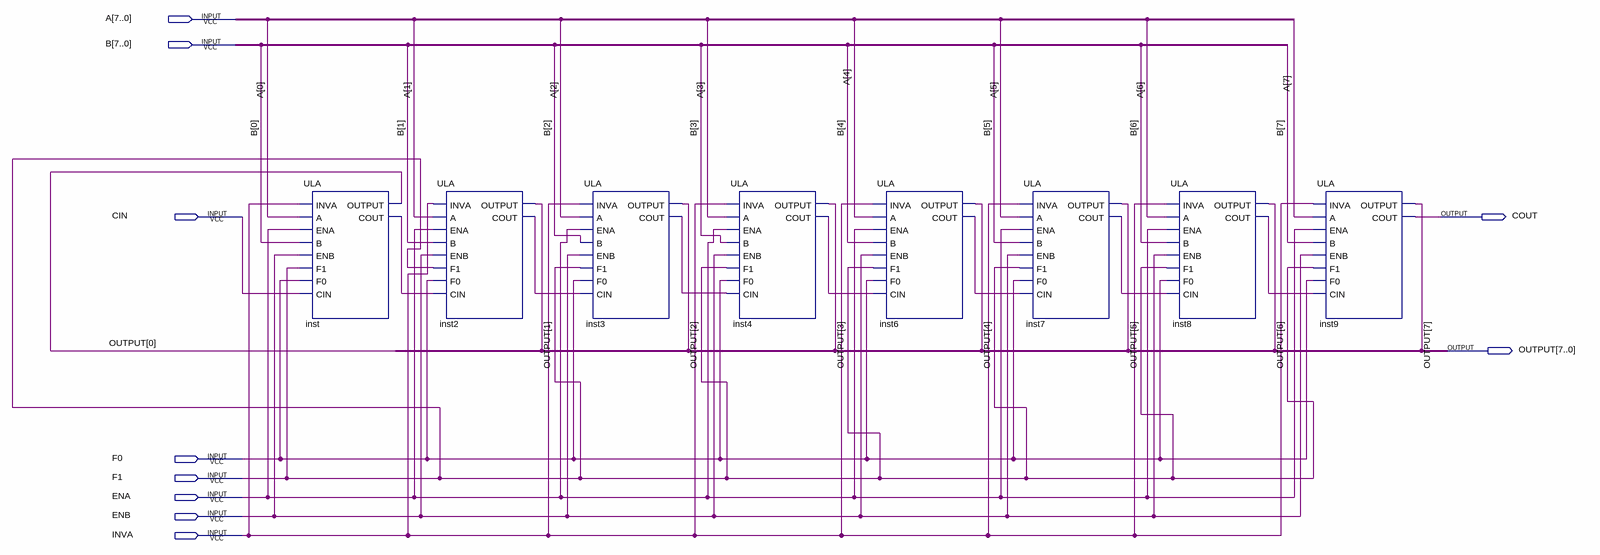
[diagram p0: schematic sheet]
// Quartus schematic ULA_8BIT.bdf as structural Verilog: 8 symbols, 10 pins
module ULA_8BIT (
  input  [7:0] A,
  input  [7:0] B,
  input  CIN,
  input  F0,
  input  F1,
  input  ENA,
  input  ENB,
  input  INVA,
  output COUT,
  output [7:0] OUTPUT
);

  wire inst2_cout, inst3_cout, inst4_cout, inst6_cout, inst7_cout, inst8_cout, inst_cout;

  ULA inst (
    .INVA(INVA), .A(A[0]), .ENA(ENA), .B(B[0]), .ENB(ENB), .F1(F1), .F0(F0), .CIN(CIN), .OUTPUT(OUTPUT[0]),
    .COUT(inst_cout));
  ULA inst2 (
    .INVA(INVA), .A(A[1]), .ENA(ENA), .B(B[1]), .ENB(ENB), .F1(F1), .F0(F0), .CIN(inst_cout),
    .OUTPUT(OUTPUT[1]), .COUT(inst2_cout));
  ULA inst3 (
    .INVA(INVA), .A(A[2]), .ENA(ENA), .B(B[2]), .ENB(ENB), .F1(F1), .F0(F0), .CIN(inst2_cout),
    .OUTPUT(OUTPUT[2]), .COUT(inst3_cout));
  ULA inst4 (
    .INVA(INVA), .A(A[3]), .ENA(ENA), .B(B[3]), .ENB(ENB), .F1(F1), .F0(F0), .CIN(inst3_cout),
    .OUTPUT(OUTPUT[3]), .COUT(inst4_cout));
  ULA inst6 (
    .INVA(INVA), .A(A[4]), .ENA(ENA), .B(B[4]), .ENB(ENB), .F1(F1), .F0(F0), .CIN(inst4_cout),
    .OUTPUT(OUTPUT[4]), .COUT(inst6_cout));
  ULA inst7 (
    .INVA(INVA), .A(A[5]), .ENA(ENA), .B(B[5]), .ENB(ENB), .F1(F1), .F0(F0), .CIN(inst6_cout),
    .OUTPUT(OUTPUT[5]), .COUT(inst7_cout));
  ULA inst8 (
    .INVA(INVA), .A(A[6]), .ENA(ENA), .B(B[6]), .ENB(ENB), .F1(F1), .F0(F0), .CIN(inst7_cout),
    .OUTPUT(OUTPUT[6]), .COUT(inst8_cout));
  ULA inst9 (
    .INVA(INVA), .A(A[7]), .ENA(ENA), .B(B[7]), .ENB(ENB), .F1(F1), .F0(F0), .CIN(inst8_cout),
    .OUTPUT(OUTPUT[7]), .COUT(COUT));
endmodule
